# EAGLE design transmission end copy (EAGLE 6.3)
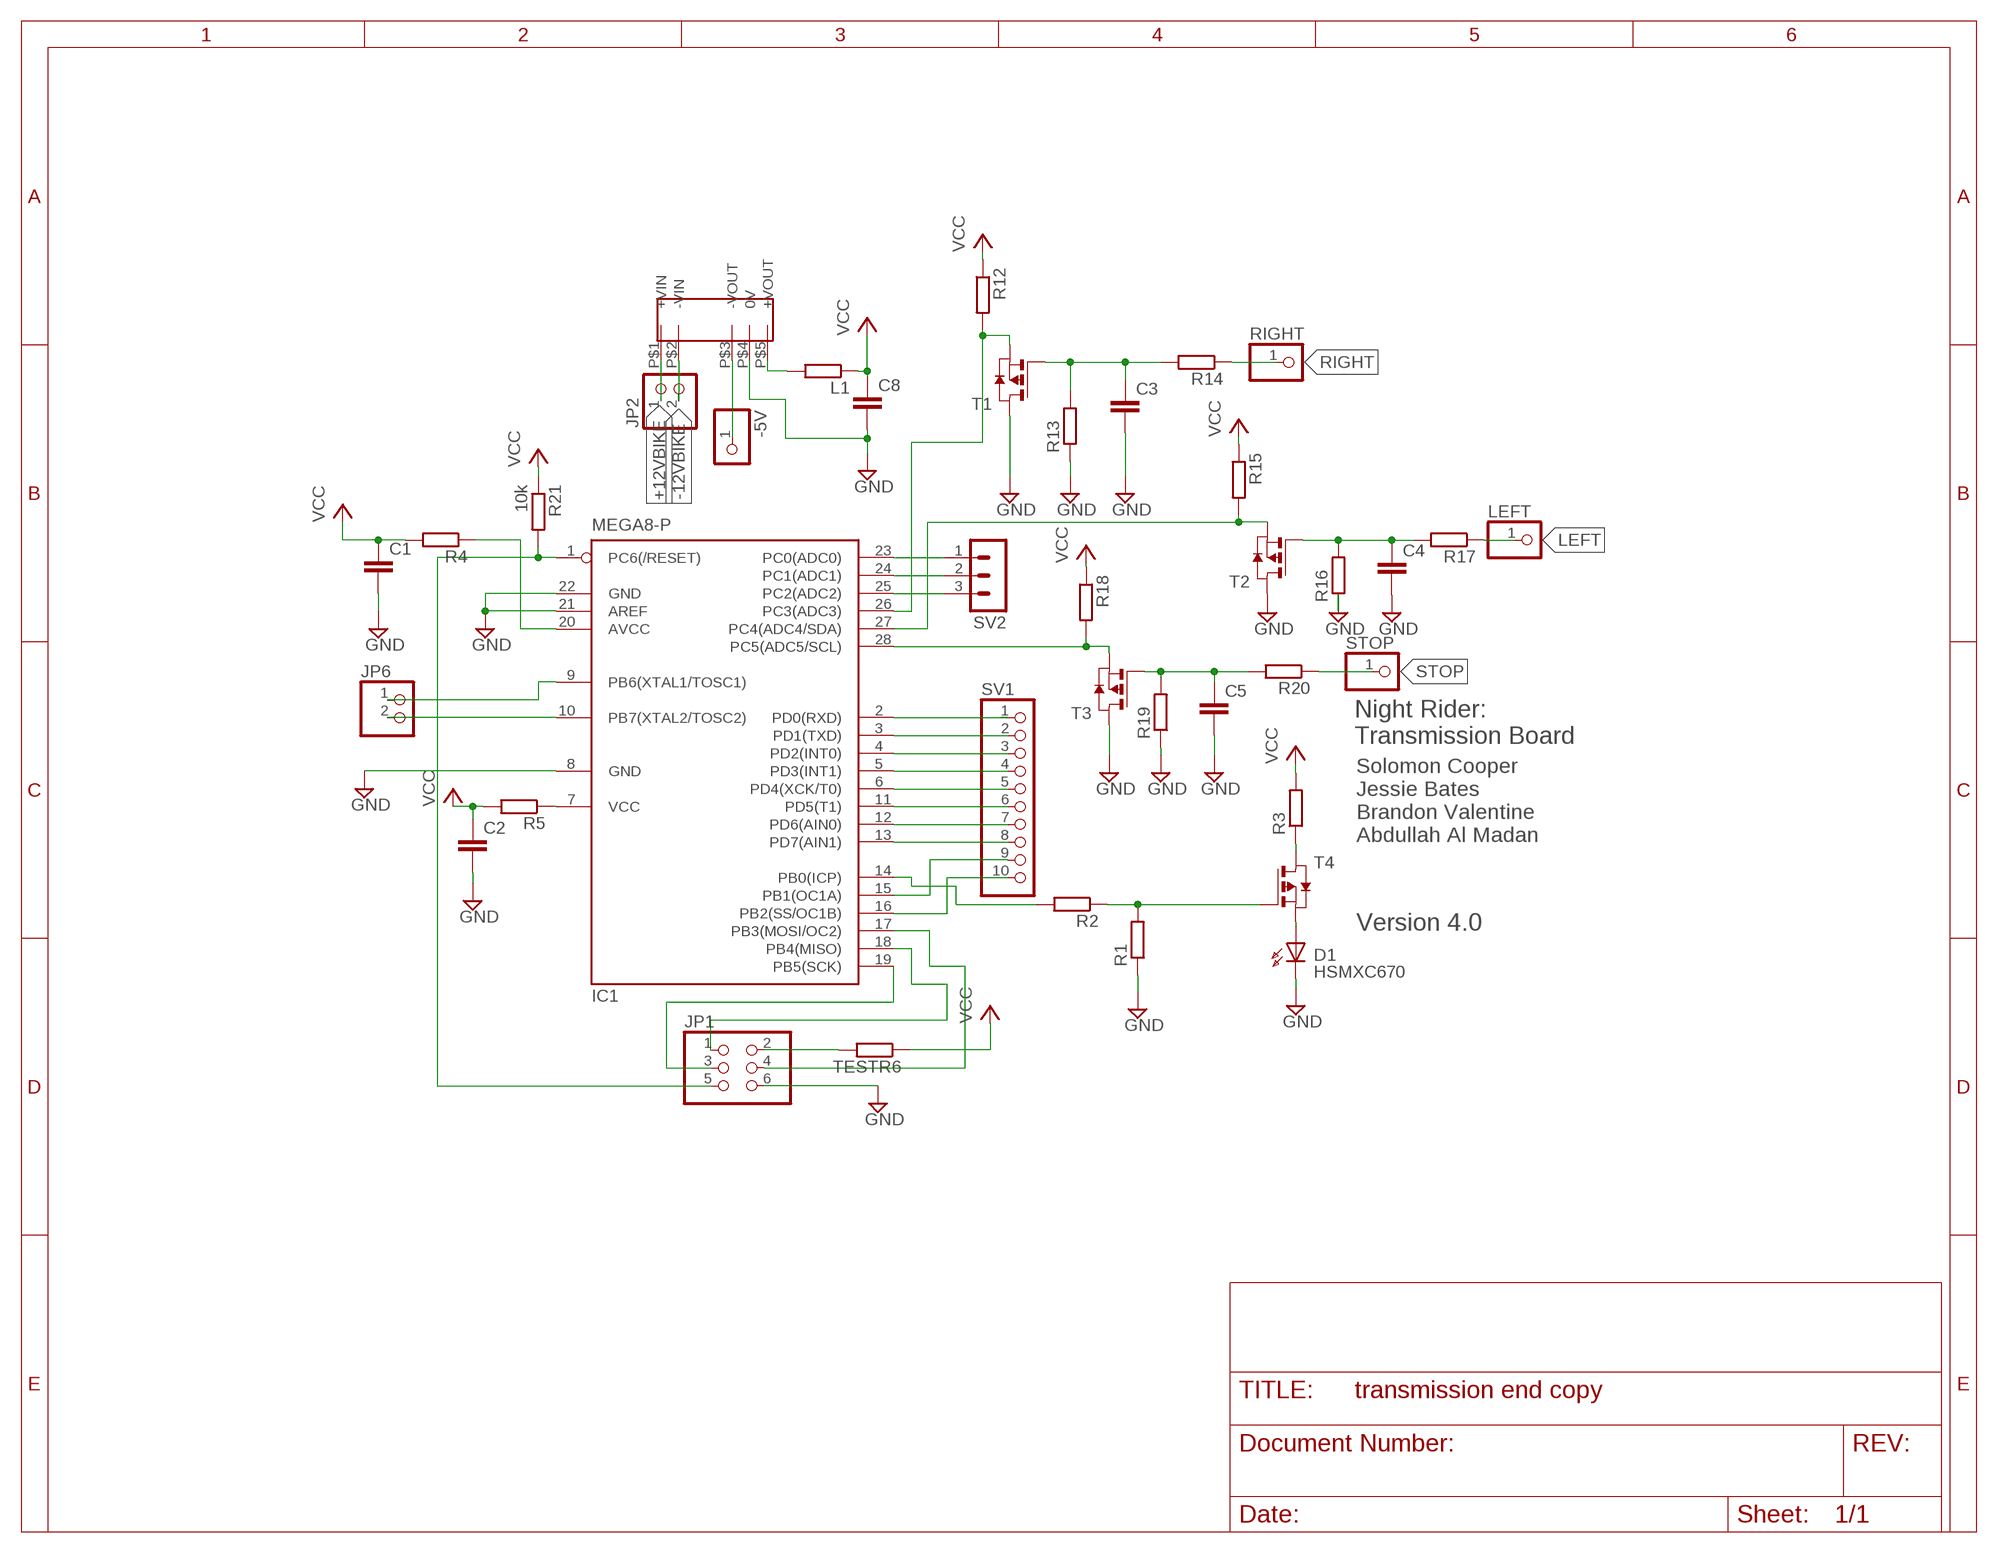
[diagram p0: schematic, sheet 1]

## Parts
-5V  PINHD-1X1  [1X01]
C1  C-EUC0805  [C0805]
C2  C-EUC0805  [C0805]
C3  C-EUC0805  [C0805]
C4  C-EUC0805  [C0805]
C5  C-EUC0805  [C0805]
C8  C-EUC0805  [C0805]
D1  HSMXC670  [HSMXC670]
IC1  MEGA8-P  [DIL28-3]
JP1  PINHD-2X3  [2X03]
JP2  PINHD-1X2  [1X02]
JP6  PINHD-1X2  [1X02]
L1  R-EU_M0805  [M0805]
LEFT  PINHD-1X1  [1X01]
R1  R-EU_M0805  [M0805]
R2  R-EU_M0805  [M0805]
R3  R-EU_M0805  [M0805]
R4  R-EU_M0805  [M0805]
R5  R-EU_M0805  [M0805]
R12  R-EU_M0805  [M0805]
R13  R-EU_M0805  [M0805]
R14  R-EU_M0805  [M0805]
R15  R-EU_M0805  [M0805]
R16  R-EU_M0805  [M0805]
R17  R-EU_M0805  [M0805]
R18  R-EU_M0805  [M0805]
R19  R-EU_M0805  [M0805]
R20  R-EU_M0805  [M0805]
R21  10k  R-EU_M0805  [M0805]
RIGHT  PINHD-1X1  [1X01]
STOP  PINHD-1X1  [1X01]
SV1  PINHD-1X10  [1X10]
SV2  MA03-1  [MA03-1]
T1  PMOSSOT23  [SOT-23]
T2  PMOSSOT23  [SOT-23]
T3  PMOSSOT23  [SOT-23]
T4  PMOSSOT23  [SOT-23]
TESTR6  R-EU_M0805  [M0805]
U$1  NKA1205SC  [NKA1205SC]

## Nets
+12VBIKE: JP2.1 U$1.P$1(+VIN)
-12VBIKE: JP2.2 U$1.P$2(-VIN)
GND: C1.2 C2.2 C3.2 C4.2 C5.2 C8.2 D1.K(C) IC1.8(GND) IC1.21(AREF) IC1.22(GND) JP1.6 R1.1 R13.1 R16.1 R19.1 T1.1(D) T2.1(D) T3.1(D) U$1.P$4(0V)
LEFT: LEFT.1 R17.1
N$1: IC1.2(PD0(RXD)) SV1.1
N$2: R1.2 R2.1 T4.3(G)
N$3: R3.1 T4.1(D)
N$4: IC1.27(PC4(ADC4/SDA)) R15.2 T2.2(S)
N$5: IC1.3(PD1(TXD)) SV1.2
N$6: D1.A T4.2(S)
N$7: IC1.1(PC6(/RESET)) JP1.5 R21.2
N$8: IC1.14(PB0(ICP)) R2.2
N$9: L1.2 U$1.P$5(+VOUT)
N$10: IC1.4(PD2(INT0)) SV1.3
N$11: -5V.1 U$1.P$3(-VOUT)
N$12: IC1.9(PB6(XTAL1/TOSC1)) JP6.1
N$13: IC1.28(PC5(ADC5/SCL)) R18.2 T3.2(S)
N$15: IC1.5(PD3(INT1)) SV1.4
N$16: IC1.6(PD4(XCK/T0)) SV1.5
N$17: IC1.11(PD5(T1)) SV1.6
N$18: IC1.12(PD6(AIN0)) SV1.7
N$19: IC1.13(PD7(AIN1)) SV1.8
N$21: IC1.15(PB1(OC1A)) SV1.9
N$22: IC1.16(PB2(SS/OC1B)) SV1.10
N$23: IC1.17(PB3(MOSI/OC2)) JP1.4
N$24: IC1.18(PB4(MISO)) JP1.1
N$25: IC1.19(PB5(SCK)) JP1.3
N$26: IC1.10(PB7(XTAL2/TOSC2)) JP6.2
N$27: IC1.23(PC0(ADC0)) SV2.1
N$28: IC1.24(PC1(ADC1)) SV2.2
N$29: IC1.25(PC2(ADC2)) SV2.3
N$30: IC1.26(PC3(ADC3)) R12.2 T1.2(S)
N$31: IC1.7(VCC) R5.1
N$32: IC1.20(AVCC) R4.1
N$33: JP1.2 TESTR6.2
N$34: C4.1 R16.2 R17.2 T2.3(G)
N$35: C3.1 R13.2 R14.2 T1.3(G)
N$37: C5.1 R19.2 R20.2 T3.3(G)
RIGHT: R14.1 RIGHT.1
STOP: R20.1 STOP.1
VCC: C1.1 C2.1 C8.1 L1.1 R3.2 R4.2 R5.2 R12.1 R15.1 R18.1 R21.1 TESTR6.1

## Notes on the sheet
- Night Rider: 
  Transmission Board
- Solomon Cooper 
  Jessie Bates
  Brandon Valentine
  Abdullah Al Madan
- Version 4.0

## Library data of the parts
-5V LEFT RIGHT STOP = pinhead:PINHD-1X1: PIN HEADER
C1-C5 C8 = rcl:C-EU: CAPACITOR, European symbol
D1 = opto-transmittter-hp:HSMXC670: OPTO TRANSMITTER; OC_FARNELL: unknown; OC_NEWARK: unknown
IC1 = atmel:MEGA8-P: MICROCONTROLLER 8 Kbytes FLASH, 1 kbytes SRAM, 512 bytes EEPROM, USART, 4-channel 10 bit ADC, 2-channel 8 bit ADC Pin compatible with Atmega48, ATMega88, ATMega168 Source: avr.lbr; OC_FARNELL: unknown; OC_NEWARK: unknown
JP1 = pinhead:PINHD-2X3: PIN HEADER
JP2 JP6 = pinhead:PINHD-1X2: PIN HEADER
L1 R1-R5 R12-R21 TESTR6 = resistor:R-EU_: RESISTOR, European symbol
SV1 = pinhead:PINHD-1X10: PIN HEADER
SV2 = con-lstb:MA03-1: PIN HEADER; OC_FARNELL: unknown; OC_NEWARK: unknown
T1-T4 = zetex:PMOSSOT23: MOS FET; OC_FARNELL: unknown; OC_NEWARK: unknown
U$1 = nka1205sc:NKA1205SC

## Board
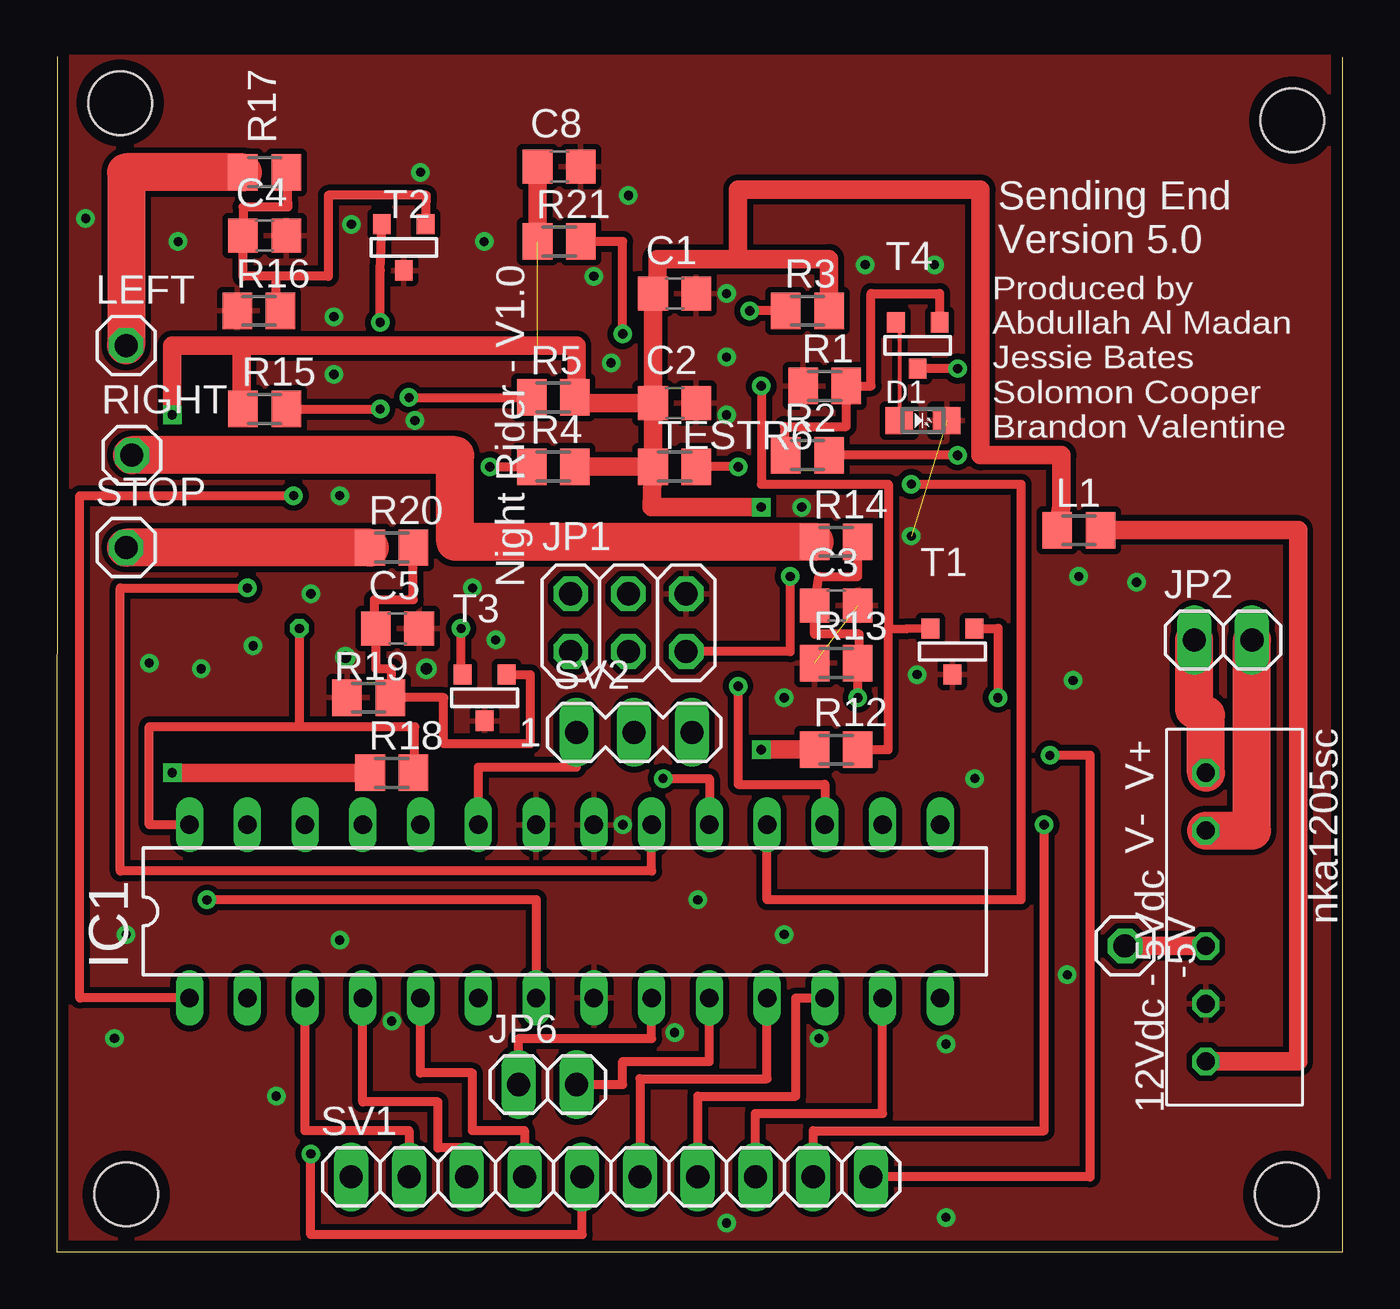
[diagram p1: board, top side]
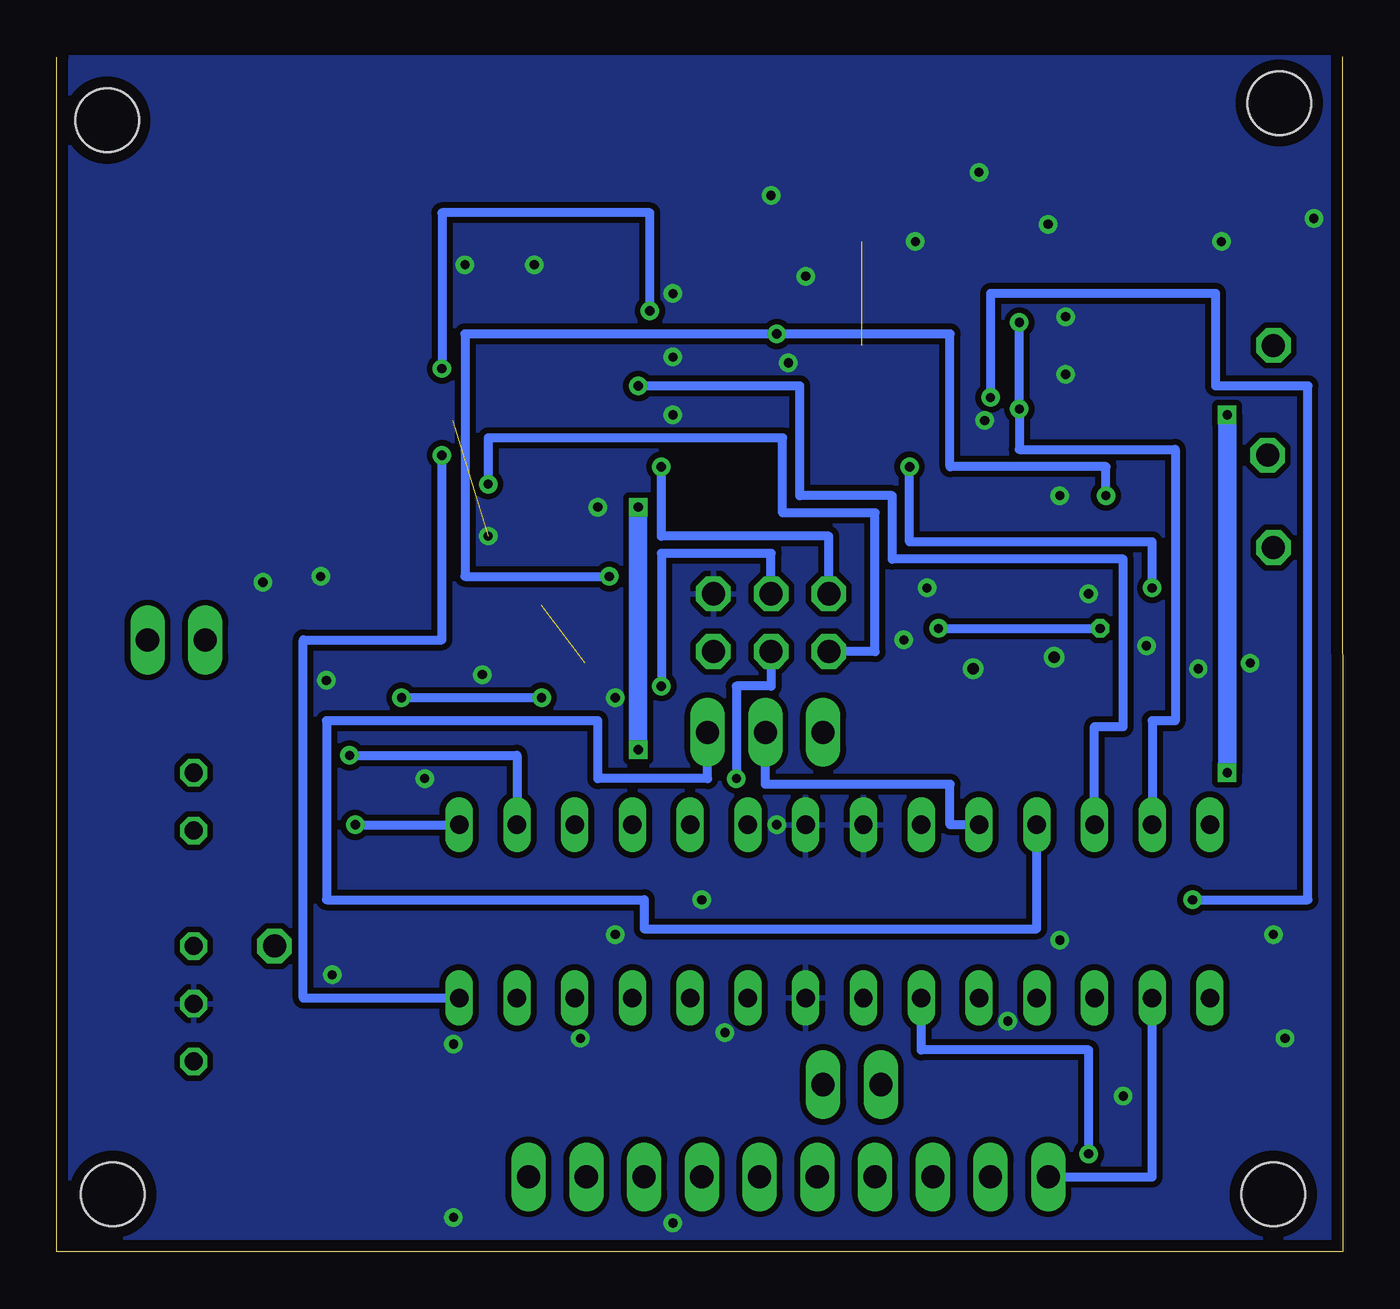
[diagram p2: board, bottom side, seen from below]

Size 56.57 x 52.58 mm. Coordinates in mm from the lower left corner, seen from the top.
Outline: 56.57,52.57 56.57,0 0,0 0.01,52.58
Copper layers (1*16): Top 0.0178mm / dielectric 59mil / Bottom 0.0178mm
Design rules "sunstone-valueproto": minimum track width 7mil, minimum drill 16mil, track to track 7mil, track to pad 7mil, pad to pad 7mil, via to via 7mil, smd to smd 7mil, copper to edge 20mil, drill to drill 16mil, minimum pad ring 8mil, minimum via ring 8mil, stop-mask expansion 3mil, vias tented up to drill 0mil, thermal gap 10mil
Holes 2.8 mm at 2.79,50.55 54.36,49.78 54.1,2.54 3.05,2.54

### Footprints (pad centres in the part's own frame; a part is rotated, then mirrored left to right if it is on the bottom)
1X01 = drill 1.016 octagon: 1 0,0
C0805 = smd 1.3 x 1.5: 1 -0.95,0; 2 0.95,0
HSMXC670 = smd 1.2 x 1.2: A -1.05,0; K 1.05,0
DIL28-3 = drill 0.813 long: 1 -16.51,-3.81; 2 -13.97,-3.81; 3 -11.43,-3.81; 4 -8.89,-3.81; 5 -6.35,-3.81; 6 -3.81,-3.81; 7 -1.27,-3.81; 8 1.27,-3.81; 9 3.81,-3.81; 10 6.35,-3.81; 11 8.89,-3.81; 12 11.43,-3.81; 13 13.97,-3.81; 14 16.51,-3.81; 15 16.51,3.81; 16 13.97,3.81; 17 11.43,3.81; 18 8.89,3.81; 19 6.35,3.81; 20 3.81,3.81; 21 1.27,3.81; 22 -1.27,3.81; 23 -3.81,3.81; 24 -6.35,3.81; 25 -8.89,3.81; 26 -11.43,3.81; 27 -13.97,3.81; 28 -16.51,3.81
2X03 = drill 1.016 octagon: 1 -2.54,-1.27; 2 -2.54,1.27; 3 0,-1.27; 4 0,1.27; 5 2.54,-1.27; 6 2.54,1.27
1X02 = drill 1.016 long: 1 -1.27,0; 2 1.27,0
M0805 = smd 1.3 x 1.6: 1 -0.95,0; 2 0.95,0
1X10 = drill 1.016 long: 1 -11.43,0; 2 -8.89,0; 3 -6.35,0; 4 -3.81,0; 5 -1.27,0; 6 1.27,0; 7 3.81,0; 8 6.35,0; 9 8.89,0; 10 11.43,0
MA03-1 = drill 1.016 long: 1 -2.54,0; 2 0,0; 3 2.54,0
SOT-23 = smd 0.787 x 0.889: 1 0.025,-1.016; 2 -0.94,1.016; 3 0.991,1.016
NKA1205SC = drill 0.8 octagon: P$1 -6.35,-1.27; P$2 -3.81,-1.27; P$3 1.27,-1.27; P$4 3.81,-1.27; P$5 6.35,-1.27

### Placement (x,y rotation side)
-5V  46.99,13.46 270 top
C1  27.18,42.16 0 top
C2  27.18,37.34 0 top
C3  34.29,28.45 0 top
C4  9.14,44.7 0 top
C5  14.99,27.43 0 top
C8  22.1,47.75 0 top
D1  38.1,36.58 0 top
IC1  22.35,14.99 0 top
JP1  25.15,27.69 0 top
JP2  51.31,26.92 0 top
JP6  21.59,7.37 0 top
L1  44.96,31.75 0 top
LEFT  3.05,39.88 0 top
R1  33.78,38.1 0 top
R2  33.02,35.05 0 top
R3  33.02,41.4 0 top
R4  21.84,34.54 0 top
R5  21.84,37.59 0 top
R12  34.29,22.1 0 top
R13  34.29,25.91 0 top
R14  34.29,31.24 0 top
R15  9.14,37.08 0 top
R16  8.89,41.4 0 top
R17  9.14,47.5 0 top
R18  14.73,21.08 0 top
R19  13.72,24.38 0 top
R20  14.73,30.99 0 top
R21  22.1,44.45 0 top
RIGHT  3.3,35.05 0 top
STOP  3.05,30.99 0 top
SV1  24.38,3.3 0 top
SV2  25.4,22.86 0 top
T1  39.37,26.42 0 top
T2  15.24,44.2 0 top
T3  18.8,24.38 0 top
T4  37.85,39.88 0 top
TESTR6  27.18,34.54 0 top
U$1  51.82,14.73 270 top

### Tracks (layer width: path | path; a pad name or v marks a point on that pad's centre or on a via)
+12VBIKE
  Top 1.676: U$1.P$1 50.55,23.62 50.04,23.88 JP2.1
-12VBIKE
  Top 1.676: U$1.P$2 52.58,18.54 JP2.2
GND  (via drill 0.41, 0.5)  (2 unrouted)
  other vias: 1.27,45.47 44.45,12.19 12.19,41.15 6.35,25.65 24.38,39.12 16,47.5 18.8,44.45 12.95,45.21 5.33,44.45 23.62,42.93 25.15,46.48 29.46,42.16 35.56,43.43 29.46,36.83 38.61,43.43 29.46,39.37 37.85,25.4 37.59,31.5 32.77,32.77 32,24.38 44.7,25.15 44.96,29.72 3.05,13.97 4.06,25.91 19.3,26.92 12.45,33.27 15.75,36.58 12.19,38.61 8.64,26.67 47.5,29.46 24.89,18.8 40.39,20.83 12.45,13.72 28.19,15.49 32,13.97 33.53,9.4 39.12,9.14 27.18,9.65 14.73,10.16 2.54,9.4 9.65,6.86 29.46,1.27 39.12,1.52 12.7,26.16 16.26,25.65 18.29,29.21 11.18,28.96
  pour Bottom (isolate 0.254): 0,0 56.64,0 56.64,52.58 0,52.58
  pour Top (isolate 0.254): 0,0 56.64,0 56.64,52.58 0,52.58
LEFT
  Top 1.676: R17.1 3.05,47.5 LEFT.1
N$1
  Bottom 0.406: IC1.2 8.38,3.3 SV1.1
N$2
  Top 0.178: 32,34.54 R2.1
  Top 0.406: 32,34.54 32,36.32 34.73,36.32 R1.2 35.81,38.1 35.81,42.16 38.84,42.16 T4.3
N$3  (via drill 0.41)
  Top 0.406: R3.1 v30.48,41.4 | v39.62,38.86 T4.1
  Bottom 0.406: v30.48,41.4 30.48,45.72 39.62,45.72 v39.62,38.86
N$4  (via drill 0.41)
  Top 0.406: T2.2 14.22,43.18 v14.22,40.89 | R15.2 v14.22,37.08
  Bottom 0.406: v14.22,40.89 v14.22,37.08 14.22,35.31 7.37,35.31 7.37,23.37 8.38,23.37 IC1.27
N$5
  Top 0.406: IC1.3 10.92,5.33 15.49,5.33 SV1.2
N$6
  Top 0.178: T4.2 37.08,40.89 37.08,37.08 D1.A
N$7  (via drill 0.41)
  Top 0.406: v24.89,40.39 24.89,44.45 R21.2 | v10.41,33.27 1.02,33.27 1.02,11.18 IC1.1 | JP1.5 32.26,26.42 v32.26,29.72
  Bottom 0.406: v10.41,33.27 10.41,34.54 17.27,34.54 17.27,40.39 v24.89,40.39 38.61,40.39 38.61,29.72 v32.26,29.72
N$8  (via drill 0.41)
  Top 0.406: v39.62,35.05 R2.2
  Bottom 0.406: v39.62,35.05 39.62,26.92 45.72,26.92 45.72,11.18 IC1.14
N$9
  Top 0.813: U$1.P$5 54.61,8.38 54.61,31.75 L1.2
N$10
  Top 0.406: IC1.4 13.46,6.6 16.76,6.6 16.76,4.57 18.03,4.57 SV1.3
N$11
  Top 0.813: U$1.P$3 -5V.1
N$12
  Top 0.406: JP6.1 20.32,9.4 26.16,9.4 IC1.9
N$13  (via drill 0.41)
  Top 0.406: 10.67,23.11 4.06,23.11 4.06,18.8 IC1.28 | 10.67,23.11 15.75,23.11 15.75,21.08 R18.2 | T3.2 17.78,25.4 v17.78,27.43 | v10.67,27.43 10.67,23.11
  Bottom 0.406: v17.78,27.43 v10.67,27.43
N$15
  Top 0.406: IC1.5 16,7.87 18.29,7.87 18.29,5.33 20.57,5.33 SV1.4
N$16  (via drill 0.41)
  Top 0.406: v11.18,4.32 11.18,0.76 23.11,0.76 SV1.5
  Bottom 0.406: v11.18,4.32 11.18,8.89 18.54,8.89 IC1.6
N$17
  Top 0.406: IC1.11 31.24,7.62 25.65,7.62 SV1.6
N$18
  Top 0.406: IC1.12 32.51,11.18 32.51,6.86 28.19,6.86 SV1.7
N$19
  Top 0.406: IC1.13 36.32,6.1 30.73,6.1 SV1.8
N$21  (via drill 0.41)
  Top 0.406: v43.43,18.8 43.43,5.33 33.27,5.33 SV1.9
  Bottom 0.406: v43.43,18.8 IC1.15
N$22  (via drill 0.41)
  Top 0.406: v43.69,21.84 45.47,21.84 45.47,3.3 SV1.10
  Bottom 0.406: IC1.16 36.32,21.84 v43.69,21.84
N$23  (via drill 0.41)
  Top 0.406: IC1.17 33.78,20.57 29.97,20.57 v29.97,24.89
  Bottom 0.406: v29.97,24.89 29.97,30.73 25.15,30.73 JP1.4
N$24  (via drill 0.41)
  Top 0.406: v37.59,33.78 42.42,33.78 42.42,15.49 31.24,15.49 IC1.18
  Bottom 0.406: v37.59,33.78 37.59,35.81 24.64,35.81 24.64,32.51 20.57,32.51 20.57,26.42 JP1.1
N$25  (via drill 0.41)
  Top 0.406: v26.67,20.83 28.7,20.83 IC1.19
  Bottom 0.406: JP1.3 25.15,24.89 26.67,24.89 v26.67,20.83
N$26
  Top 0.406: IC1.10 28.7,8.38 24.89,8.38 24.89,7.37 JP6.2
N$27
  Top 0.406: IC1.23 18.54,21.34 22.86,21.34 SV2.1
N$28
  Bottom 0.406: IC1.24 17.27,18.8 17.27,20.57 25.4,20.57 SV2.2
N$29
  Bottom 0.406: IC1.25 13.46,14.22 30.73,14.22 30.73,15.49 44.7,15.49 44.7,23.37 32.77,23.37 32.77,20.83 27.94,20.83 SV2.3
N$30  (via drill 0.41)
  Top 0.406: 36.58,27.43 37.39,27.41 38.16,27.43 T1.2 | 36.58,27.43 36.58,33.78 30.99,33.78 v30.99,38.1 | R12.2 36.58,22.1 36.58,27.43
  Bottom 0.406: v30.99,38.1 23.88,38.1 23.88,33.27 19.81,33.27 19.81,30.48 9.65,30.48 9.65,23.11 10.92,23.11 IC1.26
N$31  (via drill 0.41)
  Top 0.406: v15.49,37.59 R5.1 | v6.6,15.49 21.08,15.49 IC1.7
  Bottom 0.406: v15.49,37.59 15.49,42.16 5.59,42.16 5.59,38.1 1.52,38.1 1.52,15.49 v6.6,15.49
N$32  (via drill 0.41)
  Top 0.406: v19.05,34.54 R4.1 | v8.38,29.21 2.79,29.21 2.79,16.76 26.16,16.76 IC1.20
  Bottom 0.406: v8.38,29.21 8.38,31.24 19.05,31.24 v19.05,34.54
N$33  (via drill 0.41)
  Top 0.406: v29.97,34.54 TESTR6.2
  Bottom 0.406: v29.97,34.54 29.97,31.5 22.61,31.5 JP1.2
N$34
  Top 0.406: T2.3 16.26,46.48 11.94,46.48 11.94,42.93 9.65,42.93 | 9.65,42.93 8.19,42.93 C4.1 8.19,45.97 10.16,45.97 R17.2 | R16.2 9.65,41.4 9.65,42.93
N$35  (via drill 0.41)
  Top 0.406: T1.3 41.4,27.43 v41.4,24.38 | v35.24,24.38 R13.2 35.31,25.65 35.31,27.18 33.34,27.18 C3.1 33.53,29.72 35.24,29.72 R14.2
  Bottom 0.406: v41.4,24.38 v35.24,24.38
N$37
  Top 0.406: T3.3 20.83,25.4 20.83,22.35 17.02,22.35 17.02,24.38 14.73,24.38 | R19.2 14.73,24.38 | 14.73,24.38 14.73,25.65 14.04,25.65 C5.1 13.97,27.69 13.97,28.7 15.68,28.7 R20.2
RIGHT
  Top 1.676: R14.1 17.53,31.24 17.53,35.05 RIGHT.1
STOP
  Top 1.676: R20.1 STOP.1
VCC  (via drill 0.41)  (1 unrouted)
  Top 0.813: C8.1 R21.1 | R5.2 22.86,37.34 | 22.86,37.34 22.86,39.88 21.15,39.88 8.13,39.88 | R15.1 8.13,37.08 8.13,39.88 | 8.13,39.88 5.08,39.88 v5.08,36.83 | v5.08,21.08 R18.1 | 22.86,37.34 C2.1 | C2.1 C1.1 26.42,42.42 26.42,43.69 29.97,43.69 | R4.2 TESTR6.1 | C2.1 TESTR6.1 | TESTR6.1 26.16,32.77 v30.99,32.77 | v30.99,22.1 R12.1 | 29.97,43.69 33.97,43.69 R3.2 | L1.1 44.2,32.77 44.2,35.05 40.64,35.05 40.64,46.74 29.97,46.74 29.97,43.69
  Bottom 0.813: v5.08,36.83 v5.08,21.08 | v30.99,32.77 v30.99,22.1

### Text on the board
tPlace: Sending End / Version 5.0 | Night Rider - V1.0 | Produced by / Abdullah Al Madan / Jessie Bates / Solomon Cooper / Brandon Valentine | V+ | V-